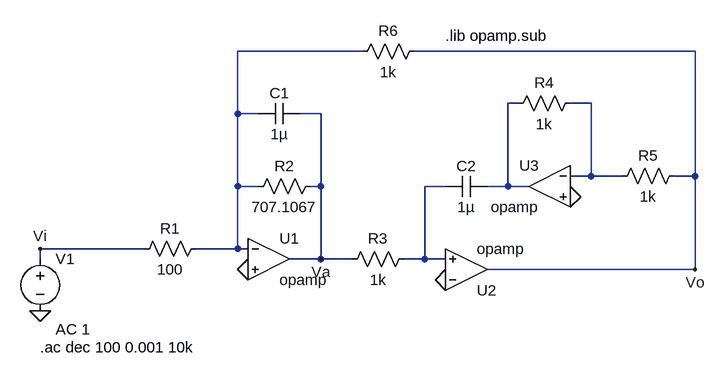
[diagram p0: schematic VoVi2.asc]
VoVi2.asc, the LTspice schematic file:
Version 4
SHEET 1 880 680
WIRE 192 -240 0 -240
WIRE 704 -240 272 -240
WIRE 432 -160 416 -160
WIRE 544 -160 512 -160
WIRE 0 -144 0 -240
WIRE 32 -144 0 -144
WIRE 128 -144 96 -144
WIRE 544 -48 544 -160
WIRE 544 -48 512 -48
WIRE 592 -48 544 -48
WIRE 704 -48 704 -240
WIRE 704 -48 672 -48
WIRE 0 -32 0 -144
WIRE 32 -32 0 -32
WIRE 128 -32 128 -144
WIRE 128 -32 112 -32
WIRE 320 -32 288 -32
WIRE 416 -32 416 -160
WIRE 416 -32 384 -32
WIRE 448 -32 416 -32
WIRE -144 64 -304 64
WIRE 0 64 0 -32
WIRE 0 64 -64 64
WIRE 16 64 0 64
WIRE -304 80 -304 64
WIRE 128 80 128 -32
WIRE 128 80 80 80
WIRE 176 80 128 80
WIRE 288 80 288 -32
WIRE 288 80 256 80
WIRE 320 80 288 80
WIRE 704 96 704 -48
WIRE 704 96 384 96
FLAG -304 160 0
FLAG 16 96 0
FLAG 320 112 0
FLAG 512 -16 0
FLAG 128 80 Va
FLAG 704 96 Vo
FLAG -304 64 Vi
SYMBOL OpAmps\\opamp 48 16 R0
SYMATTR InstName U1
SYMBOL OpAmps\\opamp 352 160 M180
SYMATTR InstName U2
SYMBOL OpAmps\\opamp 480 -96 M0
SYMATTR InstName U3
SYMBOL res -48 48 R90
WINDOW 0 0 56 VBottom 2
WINDOW 3 32 56 VTop 2
SYMATTR InstName R1
SYMATTR Value 100
SYMBOL res 128 -48 R90
WINDOW 0 0 56 VBottom 2
WINDOW 3 32 56 VTop 2
SYMATTR InstName R2
SYMATTR Value 707.1067
SYMBOL cap 32 -128 R270
WINDOW 0 32 32 VTop 2
WINDOW 3 0 32 VBottom 2
SYMATTR InstName C1
SYMATTR Value 1µ
SYMBOL res 272 64 R90
WINDOW 0 0 56 VBottom 2
WINDOW 3 32 56 VTop 2
SYMATTR InstName R3
SYMATTR Value 1k
SYMBOL cap 384 -48 R90
WINDOW 0 0 32 VBottom 2
WINDOW 3 32 32 VTop 2
SYMATTR InstName C2
SYMATTR Value 1µ
SYMBOL res 528 -176 R90
WINDOW 0 0 56 VBottom 2
WINDOW 3 32 56 VTop 2
SYMATTR InstName R4
SYMATTR Value 1k
SYMBOL res 688 -64 R90
WINDOW 0 0 56 VBottom 2
WINDOW 3 32 56 VTop 2
SYMATTR InstName R5
SYMATTR Value 1k
SYMBOL voltage -304 64 R0
WINDOW 123 24 124 Left 2
WINDOW 39 0 0 Left 0
SYMATTR Value2 AC 1
SYMATTR InstName V1
SYMATTR Value ""
SYMBOL res 288 -256 R90
WINDOW 0 0 56 VBottom 2
WINDOW 3 32 56 VTop 2
SYMATTR InstName R6
SYMATTR Value 1k
TEXT 320 -264 Left 2 !.lib opamp.sub
TEXT -304 216 Left 2 !.ac dec 100 0.001 10k

The netlist it stands for:
* VoVi2.asc
XU1 N001 0 Va opamp Aol=100K GBW=10Meg  ; pins invin noninvin out
XU2 0 N004 Vo opamp Aol=100K GBW=10Meg  ; pins invin noninvin out
XU3 N003 0 N002 opamp Aol=100K GBW=10Meg  ; pins invin noninvin out
R1 N001 Vi 100
R2 Va N001 707.1067
C1 N001 Va 1µ
R3 N004 Va 1k
C2 N002 N004 1µ
R4 N003 N002 1k
R5 Vo N003 1k
V1 Vi 0 AC 1
R6 Vo N001 1k
.lib opamp.sub
.ac dec 100 0.001 10k
.backanno
.end